# Altium schematic sheet PGA.SchDoc
size Letter; SheetNumber: 3; SheetTotal: 3
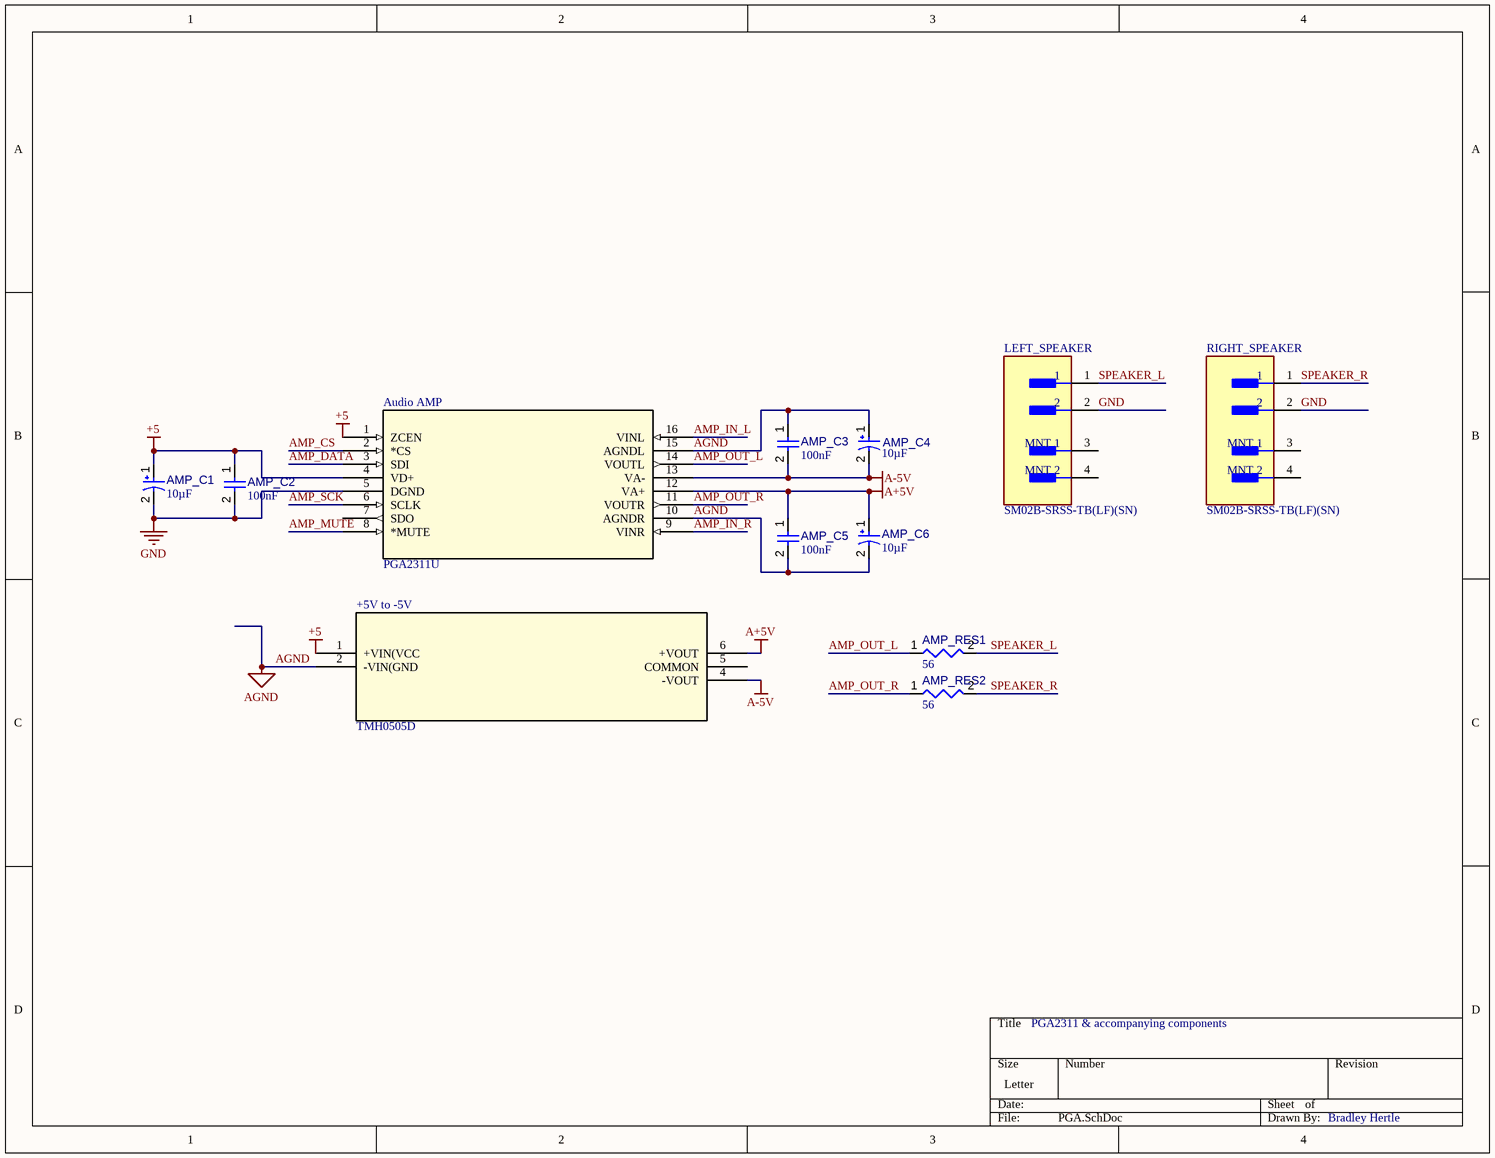
[diagram p0: PGA.SchDoc]

## Parts
+5V_to_-5V  TMH0505D  [TMH DUAL_TRP]
AMP_C1  value 10µF  [CAPMP3217X18-T_V]  (hidden comment: TAJA106K016RNJ)
AMP_C2  value 100nF  [FP-CL278-IPC_A]  (hidden comment: CL05A104KA5NNNC)
AMP_C3  value 100nF  [FP-CL278-IPC_A]  (hidden comment: CL05A104KA5NNNC)
AMP_C4  value 10µF  [CAPMP3217X18-T_V]  (hidden comment: TAJA106K016RNJ)
AMP_C5  value 100nF  [FP-CL278-IPC_A]  (hidden comment: CL05A104KA5NNNC)
AMP_C6  value 10µF  [CAPMP3217X18-T_V]  (hidden comment: TAJA106K016RNJ)
AMP_RES1  value 56  [FP-ESR10-IPC_A]  (hidden comment: ESR10EZPJ560)
AMP_RES2  value 56  [FP-ESR10-IPC_A]  (hidden comment: ESR10EZPJ560)
Audio_AMP  PGA2311U  [DW16]
LEFT_SPEAKER  SM02B-SRSS-TB(LF)(SN)  [FP-SM02B-SRSS-TB_LF_SN-0]
RIGHT_SPEAKER  SM02B-SRSS-TB(LF)(SN)  [FP-SM02B-SRSS-TB_LF_SN-0]

## Nets
+5: +5V_to_-5V.1(+VIN(VCC) AMP_C1.1 AMP_C2.1 Audio_AMP.1(ZCEN) Audio_AMP.4(VD+)
A+5V: +5V_to_-5V.6(+VOUT) AMP_C5.1 AMP_C6.1 Audio_AMP.12(VA+)
A-5V: +5V_to_-5V.4(-VOUT) AMP_C3.2 AMP_C4.2 Audio_AMP.13(VA-)
AGND: +5V_to_-5V.2(-VIN(GND) AMP_C3.1 AMP_C4.1 AMP_C5.2 AMP_C6.2 Audio_AMP.10(AGNDR) Audio_AMP.15(AGNDL)
GND: AMP_C1.2 AMP_C2.2 Audio_AMP.5(DGND) LEFT_SPEAKER.2 RIGHT_SPEAKER.2
AMP_CS: Audio_AMP.2(*CS)
AMP_DATA: Audio_AMP.3(SDI)
AMP_IN_L: Audio_AMP.16(VINL)
AMP_IN_R: Audio_AMP.9(VINR)
AMP_MUTE: Audio_AMP.8(*MUTE)
AMP_OUT_L: AMP_RES1.1 Audio_AMP.14(VOUTL)
AMP_OUT_R: AMP_RES2.1 Audio_AMP.11(VOUTR)
AMP_SCK: Audio_AMP.6(SCLK)
SPEAKER_L: AMP_RES1.2 LEFT_SPEAKER.1
SPEAKER_R: AMP_RES2.2 RIGHT_SPEAKER.1

Not connected (* = marked no-connect by the designer): +5V_to_-5V 5(COMMON); Audio_AMP 7(SDO); LEFT_SPEAKER 3(MNT_1) 4(MNT_2); RIGHT_SPEAKER 3(MNT_1) 4(MNT_2)

## Notes on the sheet
- PGA2311 & accompanying components
- Bradley Hertle

## Library data of the parts
+5V_to_-5V = CMP-019-00049-2: DC-DC Regulated Power Supply Module, 2 Output, 2W, Hybrid; RoHS Compliant: Yes; Min Operating Temperature: -40°C; Max Operating Temperature: 85°C
AMP_C1 AMP_C4 AMP_C6 = CMP-001-00041-7: Standard Tantalum, 10 uF, +/- 10%, 16 V, -55 to 125 degC, 1206 (3216 Metric), RoHS, Tape and Reel; Manufacturer: AVX; Voltage Rating: 16V; ESR: 3Ohm; Datasheet URL: http://datasheets.avx.com/TAJ.pdf; Package URL: http://www.avx.com/download/software/literature/AVX-Footprint-Library.pdf; Pins: 2; Package Reference: CAPMP3217X18-T; RoHS Compliant: True; Case/Package: 1206; Max Operating Temperature: 125°C; Package Description: 2-Pin Surface Mount Device, Body 3.2 x 1.65 mm; Mounting Technology: SM; Tolerance: 10%; Package Quantity: 1; Packaging: TapeandReel; Min Operating Temperature: -55°C; Datasheet Version: Feb-16; Manufacturer URL: http://www.avx.com/; Capacitor Type: Tantalum
AMP_C2 AMP_C3 AMP_C5 = CMP-001-00088-2: Ceramic Capacitor, Multilayer, Ceramic, 25V, 10% +Tol, 10% -Tol, X5R, 15% TC, 0.1uF, Surface Mount, 0402, 0.1uF cap; RoHS Compliant: Yes; Capacitor Type: Ceramic; Min Operating Temperature: -55°C; Max Operating Temperature: 85°C
AMP_RES1 AMP_RES2 = CMP-009-00182-1: Fixed Resistor, Metal Glaze/thick Film, 0.4W, 56ohm, 150V, 5% +/-Tol, 200ppm/Cel, Surface Mount, 0805; Min Operating Temperature: -55°C; RoHS Compliant: Yes; Max Operating Temperature: 155°C; Tolerance: 5%
Audio_AMP = CMP-005-000000-2: No Description Available; Mfr_Name: Texas Instruments; Design Item ID: PGA2311U; RefDes: RefDes; Type: Type; Source: PGA2311U.SchLib
LEFT_SPEAKER RIGHT_SPEAKER = CMP-002-00072-1: CONN HEADER SH 2POS SIDE 1MM TIN; Pins: 2